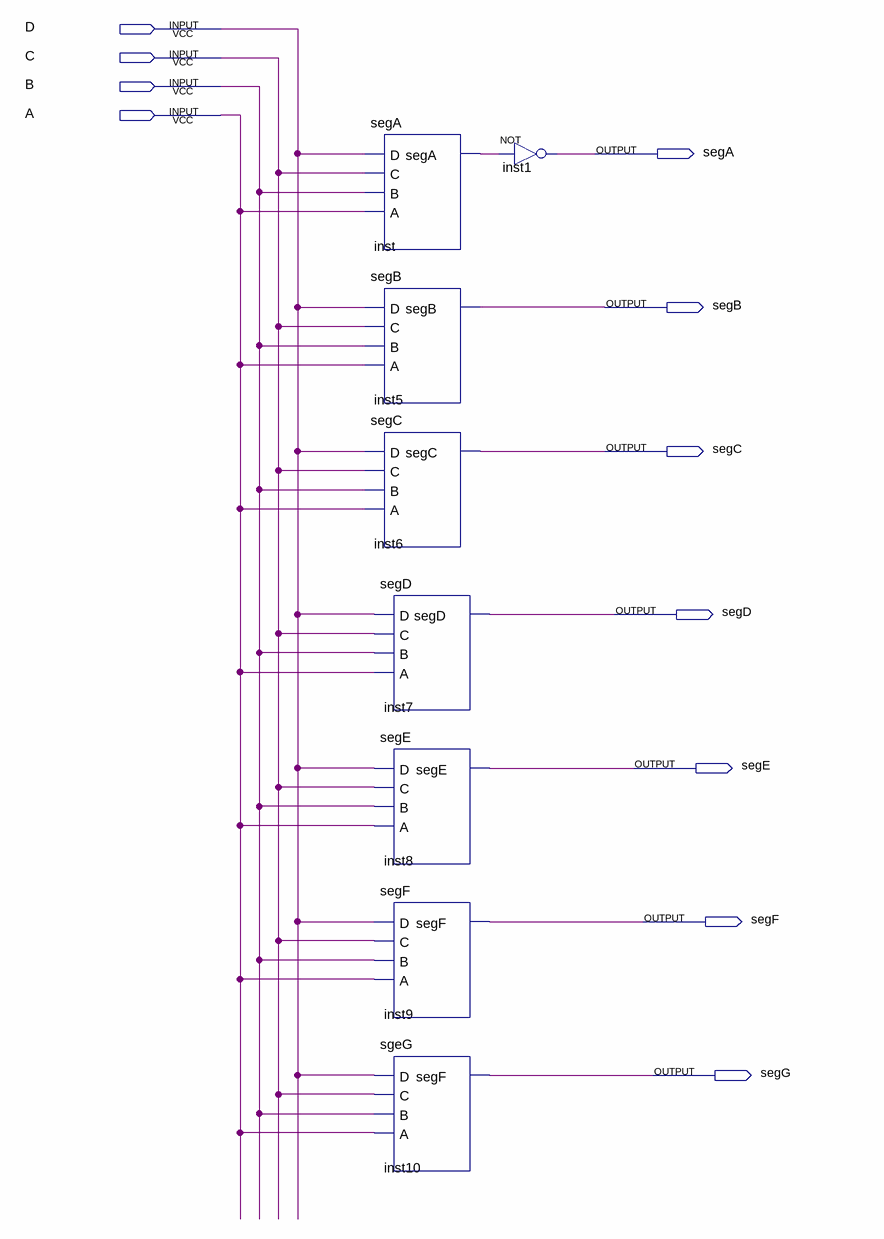
[diagram p0: schematic sheet]
// Quartus schematic HexDecoder.bdf as structural Verilog: 8 symbols, 11 pins
module HexDecoder (
  input  D,
  input  C,
  input  B,
  input  A,
  output segA,
  output segB,
  output segC,
  output segD,
  output segE,
  output segF,
  output segG
);

  wire inst_sega;

  segA inst (.D(D), .C(C), .B(B), .A(A), .segA(inst_sega));
  segB inst5 (.D(D), .C(C), .B(B), .A(A), .segB(segB));
  segC inst6 (.D(D), .C(C), .B(B), .A(A), .segC(segC));
  segD inst7 (.D(D), .C(C), .B(B), .A(A), .segD(segD));
  segE inst8 (.D(D), .C(C), .B(B), .A(A), .segE(segE));
  segF inst9 (.D(D), .C(C), .B(B), .A(A), .segF(segF));
  sgeG inst10 (.D(D), .C(C), .B(B), .A(A), .segF(segG));
  not inst1 (segA, inst_sega);
endmodule
